# EAGLE schematic Main_Board_V1.0 (EAGLE 9.6.2)
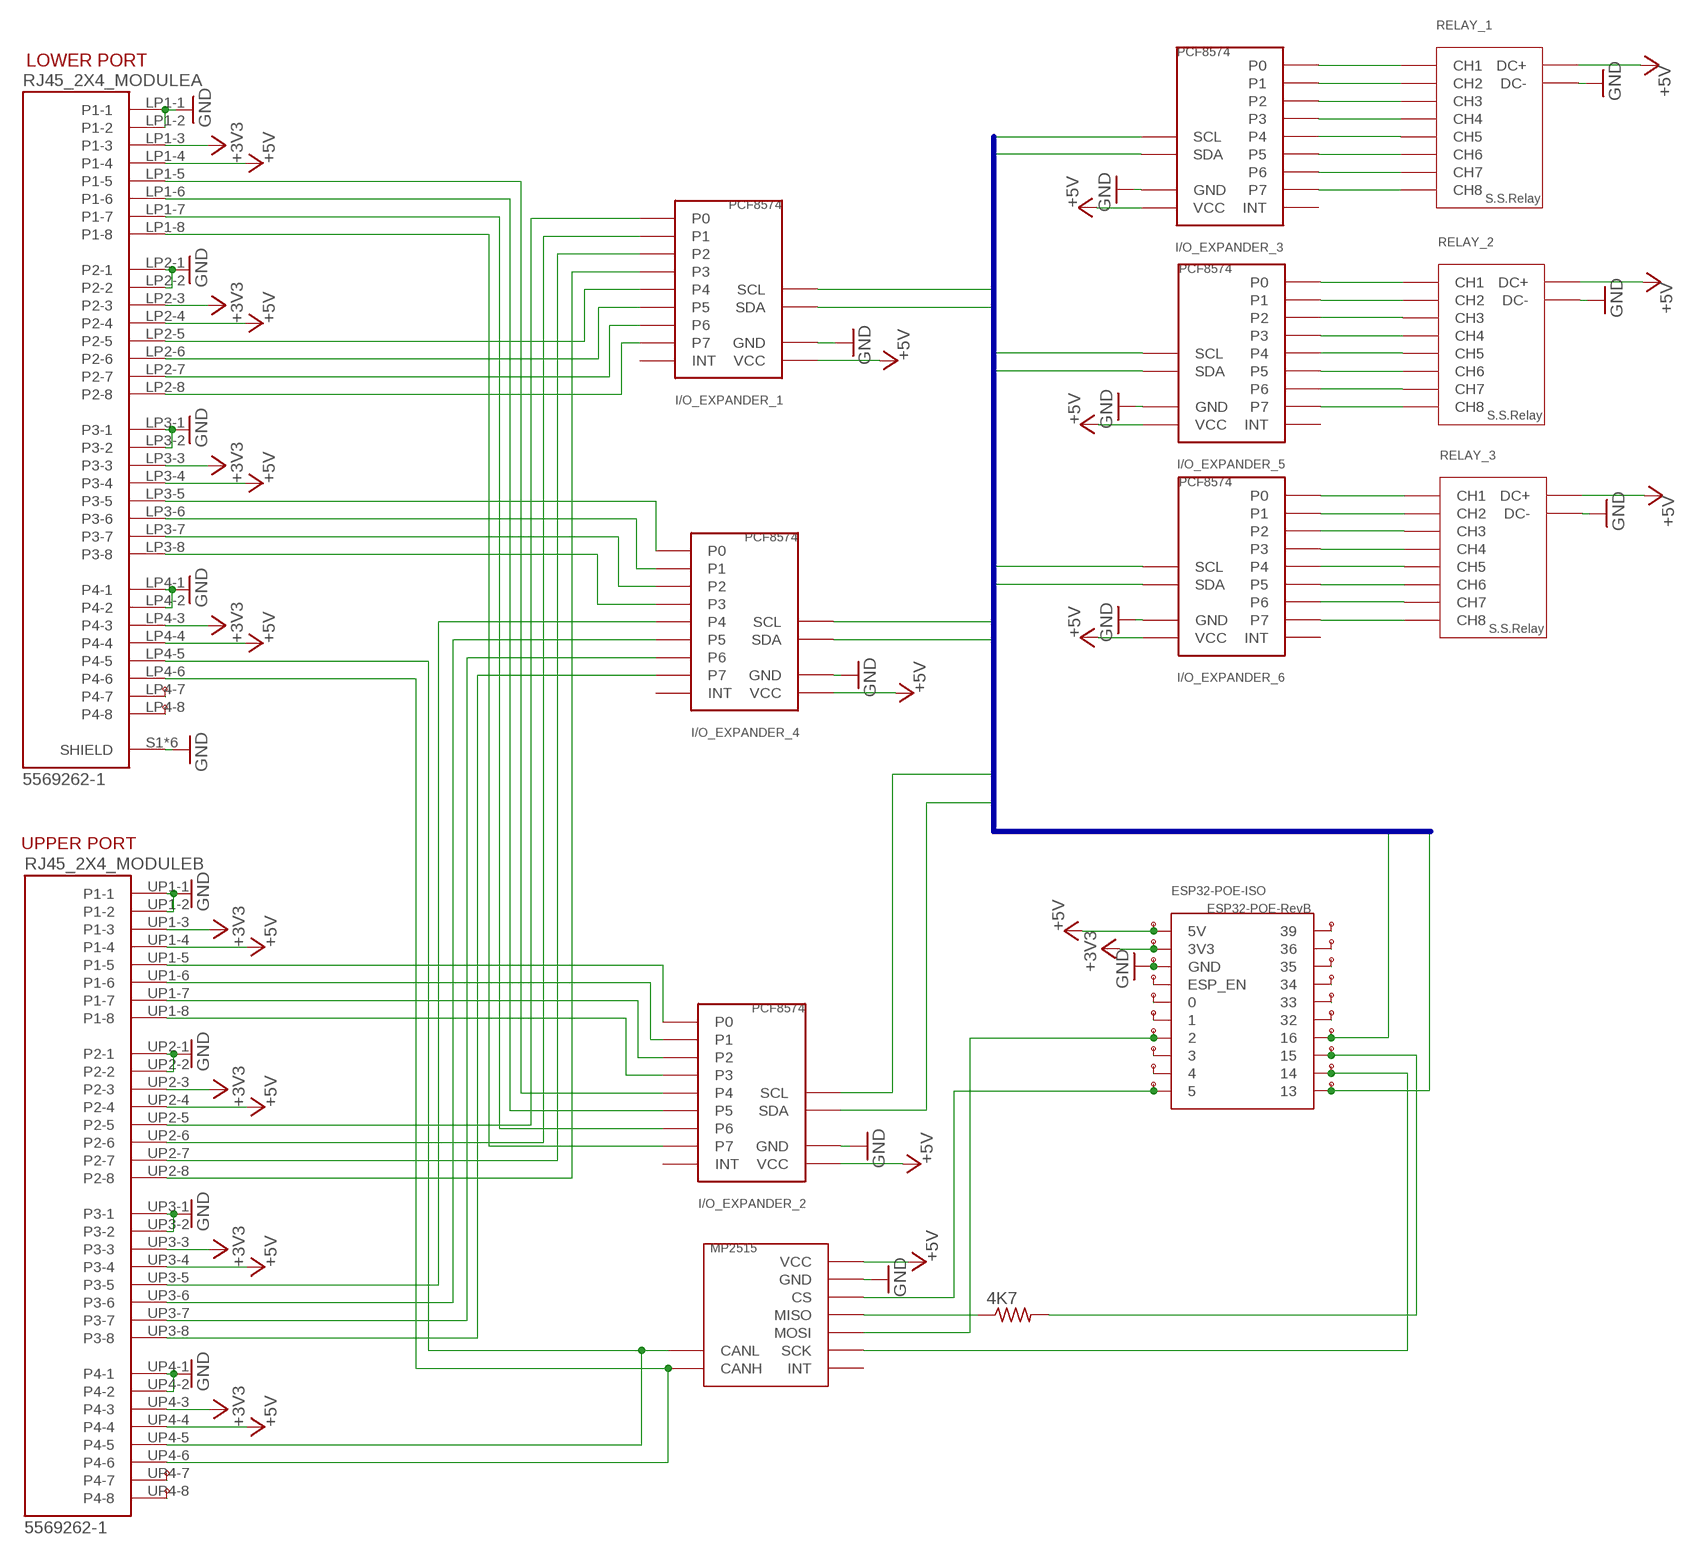
[diagram p0: schematic, sheet 1]

## Parts
4K7  R-US_0207/10  [0207/10]
ESP32-POE-ISO  ESP-POE  [ESP-POE]
I/O_EXPANDER_1  PCF8574-MODULE_ESPELHADO  [PCF8574-MODULE_ESPELHADO]
I/O_EXPANDER_2  PCF8574-MODULE_ESPELHADO  [PCF8574-MODULE_ESPELHADO]
I/O_EXPANDER_3  PCF8574-MODULE_ESPELHADO  [PCF8574-MODULE_ESPELHADO]
I/O_EXPANDER_4  PCF8574-MODULE_ESPELHADO  [PCF8574-MODULE_ESPELHADO]
I/O_EXPANDER_5  PCF8574-MODULE_ESPELHADO  [PCF8574-MODULE_ESPELHADO]
I/O_EXPANDER_6  PCF8574-MODULE_ESPELHADO  [PCF8574-MODULE_ESPELHADO]
RELAY_1  SSR_M_FULL_SEM_LIGACOES  [SSR_M_SEM_LIGACOES]
RELAY_2  SSR_M_FULL_SEM_LIGACOES  [SSR_M_SEM_LIGACOES]
RELAY_3  SSR_M_FULL_SEM_LIGACOES  [SSR_M_SEM_LIGACOES]
RJ45_2X4_MODULE  5569262-1  [TE_5569262-1]
U$1  TP  [TP]
U$2  TP  [TP]
U$4  TP  [TP]
U$5  TP  [TP]
U$6  TP  [TP]
U$7  TP  [TP]
U$8  TP  [TP]
U$9  TP  [TP]
U$10  TP  [TP]
U$11  TP  [TP]
U$12  TP  [TP]
U$13  TP  [TP]
U$14  TP  [TP]
U$15  TP  [TP]
U$16  TP  [TP]
U$17  TP  [TP]
U$18  TP  [TP]
U$19  TP  [TP]
U$20  TP  [TP]
U$21  TP  [TP]
U$22  TP  [TP]
U$23  TP  [TP]
U$24  TP  [TP]
U$25  TP  [TP]
U$26  MCP2515_MODULE_SEM_LIGACOES  [MCP2515_MODULE_SEM_LIGACOES]

## Nets
+3V3 [+3.3V]: ESP32-POE-ISO.3V3 RJ45_2X4_MODULE.LP1-3(A:P1-3) RJ45_2X4_MODULE.LP2-3(A:P2-3) RJ45_2X4_MODULE.LP3-3(A:P3-3) RJ45_2X4_MODULE.LP4-3(A:P4-3) RJ45_2X4_MODULE.UP1-3(B:P1-3) RJ45_2X4_MODULE.UP2-3(B:P2-3) RJ45_2X4_MODULE.UP3-3(B:P3-3) RJ45_2X4_MODULE.UP4-3(B:P4-3) U$6.P$1
+5V [+5V]: ESP32-POE-ISO.5V I/O_EXPANDER_1.VCC I/O_EXPANDER_2.VCC I/O_EXPANDER_3.VCC I/O_EXPANDER_4.VCC I/O_EXPANDER_5.VCC I/O_EXPANDER_6.VCC RELAY_1.DC+ RELAY_2.DC+ RELAY_3.DC+ RJ45_2X4_MODULE.LP1-4(A:P1-4) RJ45_2X4_MODULE.LP2-4(A:P2-4) RJ45_2X4_MODULE.LP3-4(A:P3-4) RJ45_2X4_MODULE.LP4-4(A:P4-4) RJ45_2X4_MODULE.UP1-4(B:P1-4) RJ45_2X4_MODULE.UP2-4(B:P2-4) RJ45_2X4_MODULE.UP3-4(B:P3-4) RJ45_2X4_MODULE.UP4-4(B:P4-4) U$2.P$1 U$26.VCC
GND [GND]: ESP32-POE-ISO.GND I/O_EXPANDER_1.GND I/O_EXPANDER_2.GND I/O_EXPANDER_3.GND I/O_EXPANDER_4.GND I/O_EXPANDER_5.GND I/O_EXPANDER_6.GND RELAY_1.DC- RELAY_2.DC- RELAY_3.DC- RJ45_2X4_MODULE.LP1-1(A:P1-1) RJ45_2X4_MODULE.LP1-2(A:P1-2) RJ45_2X4_MODULE.LP2-1(A:P2-1) RJ45_2X4_MODULE.LP2-2(A:P2-2) RJ45_2X4_MODULE.LP3-1(A:P3-1) RJ45_2X4_MODULE.LP3-2(A:P3-2) RJ45_2X4_MODULE.LP4-1(A:P4-1) RJ45_2X4_MODULE.LP4-2(A:P4-2) RJ45_2X4_MODULE.S1(A:SHIELD) RJ45_2X4_MODULE.S2(A:SHIELD) RJ45_2X4_MODULE.S3(A:SHIELD) RJ45_2X4_MODULE.S4(A:SHIELD) RJ45_2X4_MODULE.S5(A:SHIELD) RJ45_2X4_MODULE.S6(A:SHIELD) RJ45_2X4_MODULE.UP1-1(B:P1-1) RJ45_2X4_MODULE.UP1-2(B:P1-2) RJ45_2X4_MODULE.UP2-1(B:P2-1) RJ45_2X4_MODULE.UP2-2(B:P2-2) RJ45_2X4_MODULE.UP3-1(B:P3-1) RJ45_2X4_MODULE.UP3-2(B:P3-2) RJ45_2X4_MODULE.UP4-1(B:P4-1) RJ45_2X4_MODULE.UP4-2(B:P4-2) U$7.P$1 U$26.GND
N$1 [SCL]: I/O_EXPANDER_1.P7 RJ45_2X4_MODULE.LP2-8(A:P2-8)
N$2 [SCL]: I/O_EXPANDER_1.P6 RJ45_2X4_MODULE.LP2-7(A:P2-7)
N$3 [SCL]: I/O_EXPANDER_1.P5 RJ45_2X4_MODULE.LP2-6(A:P2-6)
N$4: ESP32-POE-ISO.ESP_EN U$8.P$1
N$5: ESP32-POE-ISO.0 U$9.P$1
N$6: ESP32-POE-ISO.1 U$10.P$1
N$7: ESP32-POE-ISO.2 U$11.P$1 U$26.MOSI
N$8: ESP32-POE-ISO.3 U$12.P$1
N$9: ESP32-POE-ISO.4 U$13.P$1
N$10: ESP32-POE-ISO.5 U$14.P$1 U$26.CS
N$11: ESP32-POE-ISO.39 U$15.P$1
N$12: ESP32-POE-ISO.36 U$16.P$1
N$13: ESP32-POE-ISO.35 U$17.P$1
N$14: ESP32-POE-ISO.34 U$18.P$1
N$15: ESP32-POE-ISO.33 U$19.P$1
N$16: ESP32-POE-ISO.32 U$20.P$1
N$18: 4K7.2 ESP32-POE-ISO.15 U$22.P$1
N$19: ESP32-POE-ISO.14 U$23.P$1 U$26.SCK
N$21: I/O_EXPANDER_3.P0 RELAY_1.CH1
N$22: I/O_EXPANDER_3.P1 RELAY_1.CH2
N$23: I/O_EXPANDER_3.P2 RELAY_1.CH3
N$24: I/O_EXPANDER_3.P3 RELAY_1.CH4
N$25: I/O_EXPANDER_3.P4 RELAY_1.CH5
N$26 [SCL]: I/O_EXPANDER_1.P4 RJ45_2X4_MODULE.LP2-5(A:P2-5)
N$27: I/O_EXPANDER_3.P5 RELAY_1.CH6
N$28: I/O_EXPANDER_3.P6 RELAY_1.CH7
N$29: I/O_EXPANDER_3.P7 RELAY_1.CH8
N$30: I/O_EXPANDER_6.P0 RELAY_3.CH1
N$31: I/O_EXPANDER_6.P1 RELAY_3.CH2
N$32: I/O_EXPANDER_6.P2 RELAY_3.CH3
N$33: I/O_EXPANDER_6.P3 RELAY_3.CH4
N$34: I/O_EXPANDER_6.P4 RELAY_3.CH5
N$35: I/O_EXPANDER_6.P5 RELAY_3.CH6
N$36: I/O_EXPANDER_6.P6 RELAY_3.CH7
N$37: I/O_EXPANDER_6.P7 RELAY_3.CH8
N$38: I/O_EXPANDER_5.P0 RELAY_2.CH1
N$39: I/O_EXPANDER_5.P1 RELAY_2.CH2
N$40: I/O_EXPANDER_5.P2 RELAY_2.CH3
N$41: I/O_EXPANDER_5.P3 RELAY_2.CH4
N$42: I/O_EXPANDER_5.P4 RELAY_2.CH5
N$43: I/O_EXPANDER_5.P5 RELAY_2.CH6
N$44: I/O_EXPANDER_5.P6 RELAY_2.CH7
N$45: I/O_EXPANDER_5.P7 RELAY_2.CH8
N$46 [SCL]: I/O_EXPANDER_1.P3 RJ45_2X4_MODULE.UP2-8(B:P2-8)
N$47 [SCL]: I/O_EXPANDER_1.P2 RJ45_2X4_MODULE.UP2-7(B:P2-7)
N$48 [SCL]: I/O_EXPANDER_1.P1 RJ45_2X4_MODULE.UP2-6(B:P2-6)
N$49 [SCL]: I/O_EXPANDER_1.P0 RJ45_2X4_MODULE.UP2-5(B:P2-5)
N$50 [SCL]: I/O_EXPANDER_2.P0 RJ45_2X4_MODULE.UP1-5(B:P1-5)
N$51 [SCL]: I/O_EXPANDER_2.P1 RJ45_2X4_MODULE.UP1-6(B:P1-6)
N$52 [SCL]: I/O_EXPANDER_2.P2 RJ45_2X4_MODULE.UP1-7(B:P1-7)
N$53 [SCL]: I/O_EXPANDER_2.P3 RJ45_2X4_MODULE.UP1-8(B:P1-8)
N$54 [SCL]: I/O_EXPANDER_2.P4 RJ45_2X4_MODULE.LP1-5(A:P1-5)
N$55 [SCL]: I/O_EXPANDER_2.P5 RJ45_2X4_MODULE.LP1-6(A:P1-6)
N$56 [SCL]: I/O_EXPANDER_2.P6 RJ45_2X4_MODULE.LP1-7(A:P1-7)
N$57 [SCL]: I/O_EXPANDER_2.P7 RJ45_2X4_MODULE.LP1-8(A:P1-8)
N$58 [SCL]: RJ45_2X4_MODULE.LP4-5(A:P4-5) RJ45_2X4_MODULE.UP4-5(B:P4-5) U$26.CL(CANL)
N$60 [SCL]: I/O_EXPANDER_4.P7 RJ45_2X4_MODULE.UP3-8(B:P3-8)
N$61 [SCL]: I/O_EXPANDER_4.P6 RJ45_2X4_MODULE.UP3-7(B:P3-7)
N$62 [SCL]: I/O_EXPANDER_4.P5 RJ45_2X4_MODULE.UP3-6(B:P3-6)
N$63 [SCL]: I/O_EXPANDER_4.P4 RJ45_2X4_MODULE.UP3-5(B:P3-5)
N$64: I/O_EXPANDER_4.P0 RJ45_2X4_MODULE.LP3-5(A:P3-5)
N$65: I/O_EXPANDER_4.P1 RJ45_2X4_MODULE.LP3-6(A:P3-6)
N$66: I/O_EXPANDER_4.P2 RJ45_2X4_MODULE.LP3-7(A:P3-7)
N$67: I/O_EXPANDER_4.P3 RJ45_2X4_MODULE.LP3-8(A:P3-8)
N$68: 4K7.1 U$26.MISO
N$69: RJ45_2X4_MODULE.UP4-7(B:P4-7) U$1.P$1
N$70: RJ45_2X4_MODULE.UP4-8(B:P4-8) U$4.P$1
N$71: RJ45_2X4_MODULE.LP4-7(A:P4-7) U$5.P$1
N$72: RJ45_2X4_MODULE.LP4-8(A:P4-8) U$25.P$1
N$73 [SCL]: RJ45_2X4_MODULE.LP4-6(A:P4-6) RJ45_2X4_MODULE.UP4-6(B:P4-6) U$26.CH(CANH)
SCL: ESP32-POE-ISO.16 I/O_EXPANDER_1.SCL I/O_EXPANDER_2.SCL I/O_EXPANDER_3.SCL I/O_EXPANDER_4.SCL I/O_EXPANDER_5.SCL I/O_EXPANDER_6.SCL U$21.P$1
SDA: ESP32-POE-ISO.13 I/O_EXPANDER_1.SDA I/O_EXPANDER_2.SDA I/O_EXPANDER_3.SDA I/O_EXPANDER_4.SDA I/O_EXPANDER_5.SDA I/O_EXPANDER_6.SDA U$24.P$1
Unconnected: I/O_EXPANDER_1.INT I/O_EXPANDER_2.INT I/O_EXPANDER_3.INT I/O_EXPANDER_4.INT I/O_EXPANDER_5.INT I/O_EXPANDER_6.INT U$26.INT

## Buses
I2C:SCL,SDA

## Library data of the parts
4K7 = rcl:R-US_: RESISTOR, American symbol; SPICEPREFIX: R
ESP32-POE-ISO = ESP-POE-RevB:ESP-POE
I/O_EXPANDER_1-I/O_EXPANDER_6 = PCF8574_Module:PCF8574-MODULE_ESPELHADO
RELAY_1-RELAY_3 = Solid-State-Relay_Module:SSR_M_FULL_SEM_LIGACOES
RJ45_2X4_MODULE = RJ45_2x4:5569262-1: Conn RJ-45 F 64 POS 2.54mm Solder RA Thru-Hole 64 Terminal 8 Port Cat 5 Check prices <https://pricing.snapeda.com/parts/5569262-1/TE%20Connectivity/view-part?ref=eda>; AVAILABILITY: Good; CENTERLINE_PITCH: 1.02 mm[.04 in]; COMMENT: 5569262-1; DESCRIPTION: Conn RJ-45 F 64 POS 2.54mm Solder RA Thru-Hole 64 Terminal 8 Port Cat 5 Tray; EU_ROHS_COMPLIANCE: Compliant; MF: TE Connectivity; MP: 5569262-1; NUMBER_OF_POSITIONS: 8; PACKAGE: None; PRICE: None; PURCHASE-URL: https://pricing.snapeda.com/search/part/5569262-1/?ref=eda
U$1 U$2 U$4-U$25 = edurobotParts:TP
U$26 = MCP2515_Module:MCP2515_MODULE_SEM_LIGACOES

## Net classes
0 default: width 0.15 mm
1 +5V: width 0.305 mm
2 GND: width 0.305 mm
3 +3.3V: width 0.305 mm
4 SCL: width 0.15 mm
5 SDA: width 0.15 mm